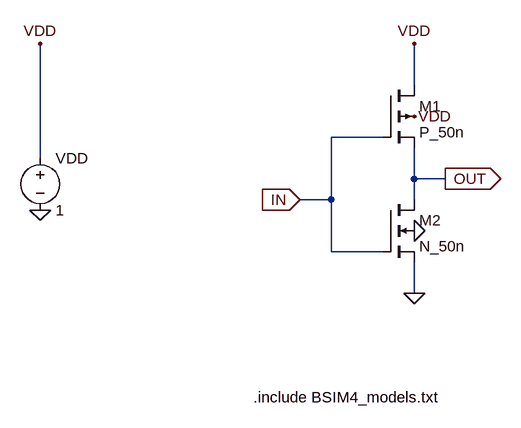
[diagram p0: schematic cmos_symbol.asc]
cmos_symbol.asc, the LTspice schematic file:
Version 4
SHEET 1 880 848
WIRE 400 352 400 288
WIRE 352 432 272 432
WIRE -176 464 -176 288
WIRE 400 496 400 448
WIRE 448 496 400 496
WIRE 272 528 272 432
WIRE 272 528 224 528
WIRE 400 528 400 496
WIRE 272 608 272 528
WIRE 352 608 272 608
WIRE 400 672 400 624
FLAG -176 544 0
FLAG 224 528 IN
IOPIN 224 528 In
FLAG 448 496 OUT
IOPIN 448 496 Out
FLAG -176 288 VDD
FLAG 400 400 VDD
FLAG 400 288 VDD
FLAG 400 672 0
FLAG 400 576 0
SYMBOL pmos4 352 352 R0
SYMATTR InstName M1
SYMATTR Value P_50n
SYMATTR Value2 l=50n w=1u
SYMBOL nmos4 352 528 R0
SYMATTR InstName M2
SYMATTR Value N_50n
SYMATTR Value2 l=50n w=500n
SYMBOL voltage -176 448 R0
SYMATTR InstName VDD
SYMATTR Value 1
TEXT 152 832 Left 2 !.include BSIM4_models.txt

The netlist it stands for:
* cmos_symbol.asc
M1 VDD IN OUT VDD P_50n l=50n w=1u
M2 OUT IN 0 0 N_50n l=50n w=500n
VDD VDD 0 1
.model NMOS NMOS
.model PMOS PMOS
.lib standard.mos
.include BSIM4_models.txt
.backanno
.end